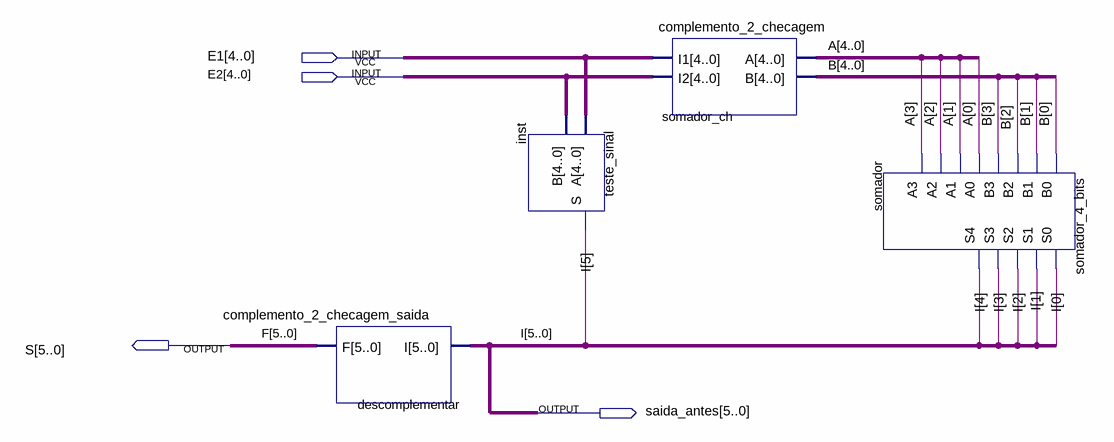
[diagram p0: schematic sheet]
// Quartus schematic somador_completo.bdf as structural Verilog: 4 symbols, 4 pins
module somador_completo (
  input  [4:0] E1,
  input  [4:0] E2,
  output [5:0] S,
  output [5:0] saida_antes
);

  wire [4:0] A, B;

  complemento_2_checagem_saida descomplementar (.I(saida_antes), .F(S));
  teste_sinal inst (.A(E1), .B(E2), .S(saida_antes[5]));
  complemento_2_checagem somador_ch (.I1(E1), .I2(E2), .A(A), .B(B));
  somador_4_bits somador (
    .B0(B[0]), .B1(B[1]), .B2(B[2]), .B3(B[3]), .A0(A[0]), .A1(A[1]), .A2(A[2]), .A3(A[3]),
    .S0(saida_antes[0]), .S1(saida_antes[1]), .S2(saida_antes[2]), .S3(saida_antes[3]), .S4(saida_antes[4]));

  // Other names for the same wires on the sheet: F[5:0] = S; I[5:0] = saida_antes
endmodule
